# EAGLE design DDS_v1 (EAGLE 7.1.0)
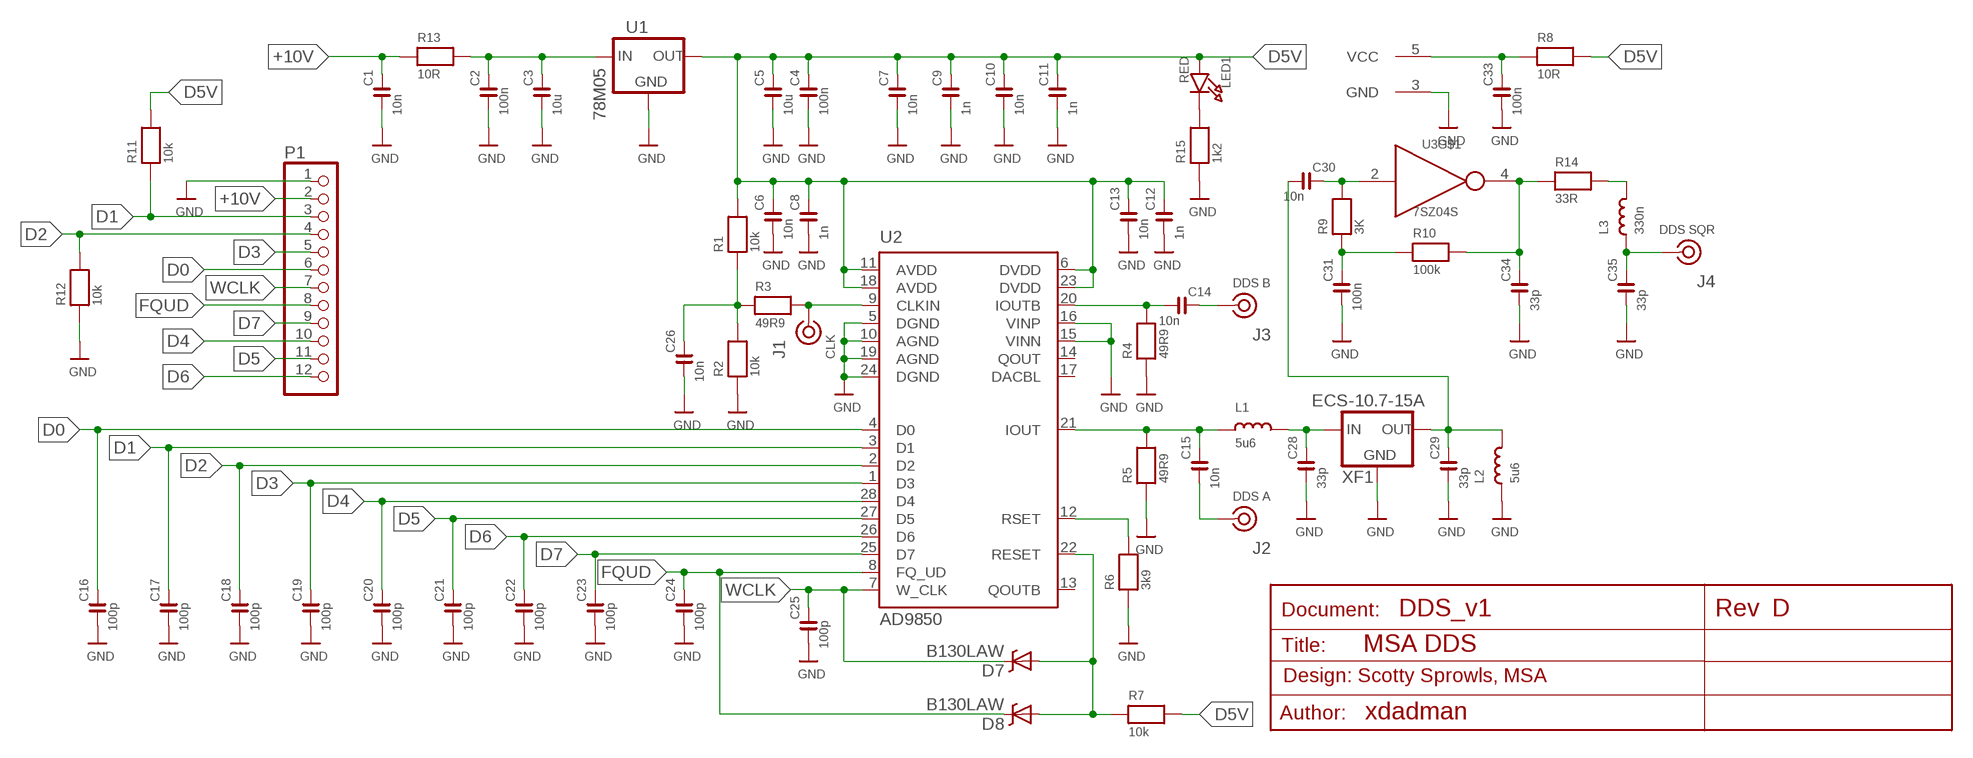
[diagram p0: schematic, sheet 1]

## Parts
C1  10n  C080510N  [C0805]
C2  100n  C0805100N  [C0805]
C3  10u  CC120610U  [C1206]
C4  100n  C0805100N  [C0805]
C5  10u  CC120610U  [C1206]
C6  10n  C080510N  [C0805]
C7  10n  C080510N  [C0805]
C8  1n  C08051N  [C0805]
C9  1n  C08051N  [C0805]
C10  10n  C080510N  [C0805]
C11  1n  C08051N  [C0805]
C12  1n  C08051N  [C0805]
C13  10n  C080510N  [C0805]
C14  10n  C080510N  [C0805]
C15  10n  C080510N  [C0805]
C16  100p  C0805100P  [C0805]
C17  100p  C0805100P  [C0805]
C18  100p  C0805100P  [C0805]
C19  100p  C0805100P  [C0805]
C20  100p  C0805100P  [C0805]
C21  100p  C0805100P  [C0805]
C22  100p  C0805100P  [C0805]
C23  100p  C0805100P  [C0805]
C24  100p  C0805100P  [C0805]
C25  100p  C0805100P  [C0805]
C26  10n  C080510N  [C0805]
C28  33p  C080533P  [C0805]
C29  33p  C080533P  [C0805]
C30  10n  C080510N  [C0805]
C31  100n  C0805100N  [C0805]
C33  100n  C0805100N  [C0805]
C34  33p  C080533P  [C0805]
C35  33p  C080533P  [C0805]
D7  B130LAW  B130LAW-7-FB130LAW-7-F  [SOD-123]
D8  B130LAW  B130LAW-7-FB130LAW-7-F  [SOD-123]
J1  CLK  COAX  [SLIM_COAX_PAD]
J2  DDS A  COAX  [SLIM_COAX_PAD]
J3  DDS B  COAX  [SLIM_COAX_PAD]
J4  DDS SQR  COAX  [SLIM_COAX_PAD]
L1  5u6  L08055U6  [L805]
L2  5u6  L08055U6  [L805]
L3  330n  L0805330N  [L805]
LED1  RED  LED_0603_RED0603  [CHIPLED_0603]
P1  PINHD-1X12  [1X12]
R1  10k  R080510K  [R0805]
R2  10k  R080510K  [R0805]
R3  49R9  R080549R9  [R0805]
R4  49R9  R080549R9  [R0805]
R5  49R9  R080549R9  [R0805]
R6  3k9  R08053K9  [R0805]
R7  10k  R080510K  [R0805]
R8  10R  R080510R  [R0805]
R9  3K  R08053K  [R0805]
R10  100k  R0805100K  [R0805]
R11  10k  R080510K  [R0805]
R12  10k  R080510K  [R0805]
R13  10R  R080510R  [R0805]
R14  33R  R080533R  [R0805]
R15  1k2  R08051K2  [R0805]
U1  78M05  78MXXLDPAK  [TO252]
U2  AD9850  [SSOP28]
U3  7SZ04S  7SZ04SOT-23  [SOT23-5L]
XF1  ECS-10.7-15A  XTALFILTER  [XTALFILTER]

## Nets
+10V: C1.2 P1.2 R13.1
D0: C16.2 P1.6 U2.4(D0)
D1: C17.2 P1.3 R11.1 U2.3(D1)
D2: C18.2 P1.4 R12.2 U2.2(D2)
D3: C19.2 P1.5 U2.1(D3)
D4: C20.2 P1.10 U2.28(D4)
D5: C21.2 P1.11 U2.27(D5)
D5V: C4.2 C5.2 C6.2 C7.2 C8.2 C9.2 C10.2 C11.2 C12.2 C13.2 LED1.A R1.2 R7.2 R8.2 R11.2 U1.2(OUT) U2.6(DVDD) U2.11(AVDD) U2.18(AVDD) U2.23(DVDD)
D6: C22.2 P1.12 U2.26(D6)
D7: C23.2 P1.9 U2.25(D7)
FQUD: C24.2 D8.C P1.8 U2.8(FQ_UD)
GND: C1.1 C2.1 C3.1 C4.1 C5.1 C6.1 C7.1 C8.1 C9.1 C10.1 C11.1 C12.1 C13.1 C16.1 C17.1 C18.1 C19.1 C20.1 C21.1 C22.1 C23.1 C24.1 C25.1 C26.1 C28.1 C29.1 C31.1 C33.1 C34.1 C35.1 L2.1 P1.1 R2.1 R4.1 R5.1 R6.1 R12.1 R15.1 U1.3(GND) U2.5(DGND) U2.10(AGND) U2.15(VINN) U2.16(VINP) U2.19(AGND) U2.24(DGND) U3.3(GND) XF1.3(GND)
N$1: C30.2 R9.2 U3.2(IN)
N$2: C33.2 R8.1 U3.5(VCC)
N$3: C15.2 L1.1 R5.2 U2.21(IOUT)
N$4: C26.2 R1.1 R2.2 R3.1
N$5: C35.2 J4.SIG L3.1
N$6: C14.2 J3.SIG
N$7: C14.1 R4.2 U2.20(IOUTB)
N$8: D7.A D8.A R7.1 U2.22(RESET)
N$9: C2.2 C3.2 R13.2 U1.1(IN)
N$10: R6.2 U2.12(RSET)
N$11: C15.1 J2.SIG
N$12: C28.2 L1.2 XF1.2(IN)
N$13: C31.2 R9.1 R10.1
N$14: C29.2 C30.1 L2.2 XF1.1(OUT)
N$15: L3.2 R14.2
N$16: C34.2 R10.2 R14.1 U3.4(OUT)
N$17: LED1.C R15.2
N$18: J1.SIG R3.2 U2.9(CLKIN)
WCLK: C25.2 D7.C P1.7 U2.7(W_CLK)
Unconnected: U2.13(QOUTB) U2.14(QOUT) U2.17(DACBL)

## Notes on the sheet
- D
- MSA DDS
- Design: Scotty Sprowls, MSA
- xdadman

## Power pins joined to a net without a drawn wire
GND: J1.GND J2.GND J3.GND J4.GND

## Library data of the parts
C1 C6 C7 C10 C13-C15 C26 C30 = MSA_lib:C0805: Ceramic capacitor; OC_FARNELL: 1414662
C2 C4 C31 C33 = MSA_lib:C0805: Ceramic capacitor; OC_FARNELL: 1759166
C3 C5 = MSA_lib:CC1206: Capacitor ceramic 1206; OC_FARNELL: 1611967
C8 C9 C11 C12 = MSA_lib:C0805: Ceramic capacitor; OC_FARNELL: 1833879
C16-C25 = MSA_lib:C0805: Ceramic capacitor; OC_FARNELL: 1414656
C28 C29 C34 C35 = MSA_lib:C0805: Ceramic capacitor; OC_FARNELL: 1800816
D7 D8 = MSA_lib:B130LAW-7-F: Diode shottky; OC_FARNELL: 1858617
J1-J4 = MSA_lib:COAX
L1 L2 = MSA_lib:L0805: 0805 Inductor; OC_FARNELL: 1669565
L3 = MSA_lib:L0805: 0805 Inductor; OC_FARNELL: 9527923
LED1 = MSA_lib:LED_0603_RED: Chip LED 0603 RED 2ma; OC_FARNELL: 1685068
P1 = MSA_lib:PINHD-1X12: PIN HEADER
R1 R2 R7 R11 R12 = MSA_lib:R0805: Resistors; OC_FARNELL: 2073607
R3-R5 = MSA_lib:R0805: Resistors; OC_FARNELL: 2312274
R6 = MSA_lib:R0805: Resistors; OC_FARNELL: 2332079
R8 R13 = MSA_lib:R0805: Resistors; OC_FARNELL: 2332043
R9 = MSA_lib:R0805: Resistors; OC_FARNELL: 2333540
R10 = MSA_lib:R0805: Resistors; OC_FARNELL: 2332098
R14 = MSA_lib:R0805: Resistors; OC_FARNELL: 2331774
R15 = MSA_lib:R0805: Resistors; OC_FARNELL: 9333827
U1 = MSA_lib:78MXXL: VOLTAGE REGULATOR; OC_FARNELL: 2382524
U2 = MSA_lib:AD9850: DDS; OC_FARNELL: 2308695
U3 = MSA_lib:7SZ04; OC_FARNELL: 1417667
XF1 = MSA_lib:XTALFILTER: XTAL Filter ECS-10.7-15A; OC_DIGIKEY: ECS-10.7-15A

## Net classes
1 Cleaerance 20: clearance 0.508 mm

## Board

Size 64 x 32 mm. Coordinates in mm from the lower left corner, seen from the top.
Outline: 0,0 64,0 64,32 0,32 0,0
Copper layers (1*16): Top 0.035mm / dielectric 1.5mm / Bottom 0.035mm
Design rules "kuba_no_CLR": minimum track width 8mil, minimum drill 15mil, track to track 8mil, track to pad 8mil, pad to pad 8mil, via to via 8mil, smd to smd 8mil, copper to edge 0mil, drill to drill 8mil, minimum pad ring 12mil, minimum via ring 10mil, stop-mask expansion 4mil, vias tented up to drill 0mil, thermal gap 10mil

### Footprints (pad centres in the part's own frame; a part is rotated, then mirrored left to right if it is on the bottom)
C0805 = smd 1.2 x 1.5: 1 -0.953,0; 2 0.953,0
C1206 = smd 1.6 x 1.8: 1 -1.4,0; 2 1.4,0
SOD-123 = smd 1.4 x 1.4: A 1.85,0; C -1.85,0
SLIM_COAX_PAD = smd 1.27 x 0.635 bottom: GND 0,-2.667 | drill 1.1: SIG 0,0
L805 = smd 1.3 x 1.5: 1 -0.95,0; 2 0.95,0
CHIPLED_0603 = smd 0.8 x 0.8: A 0,-0.75; C 0,0.75
1X12 = drill 1.016: 1 -13.97,0; 2 -11.43,0; 3 -8.89,0; 4 -6.35,0; 5 -3.81,0; 6 -1.27,0; 7 1.27,0; 8 3.81,0; 9 6.35,0; 10 8.89,0; 11 11.43,0; 12 13.97,0
R0805 = smd 1.3 x 1.5: 1 -0.95,0; 2 0.95,0
TO252 = smd 1 x 1.6: 1 -2.28,-4.8; 2 2.28,-4.8 | smd 5.4 x 6.2: 3 0,2.5
SSOP28 = smd 0.42 x 1.34: 1 -4.16,-3.6; 2 -3.52,-3.6; 3 -2.88,-3.6; 4 -2.24,-3.6; 5 -1.6,-3.6; 6 -0.96,-3.6; 7 -0.32,-3.6; 8 0.32,-3.6; 9 0.96,-3.6; 10 1.6,-3.6; 11 2.24,-3.6; 12 2.88,-3.6; 13 3.52,-3.6; 14 4.16,-3.6; 15 4.16,3.6; 16 3.52,3.6; 17 2.88,3.6; 18 2.24,3.6; 19 1.6,3.6; 20 0.96,3.6; 21 0.32,3.6; 22 -0.32,3.6; 23 -0.96,3.6; 24 -1.6,3.6; 25 -2.24,3.6; 26 -2.88,3.6; 27 -3.52,3.6; 28 -4.16,3.6
SOT23-5L = smd 0.55 x 1.2: 1 -0.95,-1.3; 2 0,-1.3; 3 0.95,-1.3; 4 0.95,1.3; 5 -0.95,1.3
XTALFILTER = smd 1 x 1.6: 1 -2.28,-4.8; 2 2.28,-4.8 | smd 10 x 10: 3 0,2

### Placement (x,y rotation side)
C1  12.45,24.13 270 top
C2  5.84,19.56 180 top
C3  7.62,23.88 90 top
C4  30.99,5.08 180 top
C5  4.83,9.14 0 top
C6  37.59,8.64 90 top
C7  20.83,6.1 90 top
C8  35.31,8.64 90 top
C9  23.11,6.1 90 top
C10  38.61,13.97 270 top
C11  36.58,13.97 270 top
C12  21.08,14.73 270 top
C13  19.05,14.73 270 top
C14  42.16,8.64 270 top
C15  53.59,3.81 180 top
C16  23.37,24.13 270 top
C17  14.73,24.13 270 top
C18  18.8,24.13 270 top
C19  21.08,24.13 270 top
C20  36.07,24.13 270 top
C21  38.35,24.13 270 top
C22  40.64,24.13 270 top
C23  33.78,24.13 270 top
C24  31.5,24.13 270 top
C25  25.65,24.13 270 top
C26  18.54,6.1 90 top
C28  53.59,6.1 180 top
C29  50.29,17.27 180 top
C30  50.29,21.84 0 top
C31  54.1,24.13 0 top
C33  49.28,27.43 270 top
C34  54.61,27.18 90 top
C35  59.44,20.83 180 top
D7  27.69,24.89 90 top
D8  29.46,24.89 90 top
J1  22.35,11.18 0 top
J2  57.91,5.08 90 top
J3  40.13,5.08 0 top
J4  57.66,23.37 0 top
L1  50.55,5.33 90 top
L2  50.29,19.56 180 top
L3  60.45,25.15 90 top
LED1  5.08,6.35 180 top
P1  24.89,21.08 0 top
R1  14.22,8.38 90 top
R2  16.26,6.1 90 top
R3  20.32,11.18 0 top
R4  39.88,8.64 90 top
R5  42.93,13.97 270 top
R6  26.16,5.33 0 top
R7  40.39,13.97 270 top
R8  41.91,27.69 180 top
R9  54.1,21.84 180 top
R10  56.9,27.18 90 top
R11  17.02,14.73 270 top
R12  16.76,24.13 270 top
R13  10.16,24.13 90 top
R14  59.69,27.94 0 top
R15  4.32,4.06 0 top
U1  9.91,14.48 270 top
U2  29.46,12.45 270 top
U3  51.82,26.92 0 top
XF1  55.88,13.21 270 top

### Tracks (layer width: path | path; a pad name or v marks a point on that pad's centre or on a via)
+10V
  Top 1.016: P1.2 12.45,22.1 C1.2 R13.1
D0
  Top 0.406: U2.4 26.88,14.69 27.18,14.99 27.18,17.02 23.88,20.32 23.88,20.83 P1.6 23.62,22.92 C16.2
D1
  Top 0.406: U2.3 24.04,15.33 22.1,17.27 17.02,17.27 16.76,17.02
  Top 0.61: C17.2 14.73,22.1 15.75,21.08 P1.3 16,20.83 16.76,20.07 16.76,17.02 16.76,15.94 R11.1
D2
  Top 0.406: U2.2 24.42,15.97 22.35,18.03 21.59,18.03 P1.4
  Top 0.61: R12.2 C18.2 18.8,21.34 P1.4
D3
  Top 0.406: U2.1 25.56,16.61 P1.5 C19.2
D4
  Top 0.406: U2.28 33.06,20.36 P1.10 33.97,21.08 C20.2
D5
  Top 0.406: U2.27 34,15.97 34.29,16.26 34.29,19.05 P1.11 36.32,21.14 C21.2
D5V
  Top 0.305: R7.2 C10.2 C11.2 36.51,12.95 35.56,12.95 35.11,13.41 U2.23 30.68,13.41 29.46,12.19 29.46,10.25 29.51,10.21 | 29.51,10.21 U2.18 34.69,10.21 C8.2 C6.2 | 29.51,10.21 29.46,10.16 29.42,10.21 U2.11 24.94,10.21 23.11,8.38 C9.2
  Top 0.406: 5.33,12.2 U1.2 3.56,13.75 3.56,23.62 8.13,28.19 40.39,28.19 40.89,27.69 R8.2 | U2.6 24.84,13.41 24.64,13.21 21.65,13.21 C12.2 C13.2 | LED1.A 5.96,7.1 6.23,7.37
  Top 0.61: 29.46,5.08 29.46,4.32 28.7,3.56 8.47,3.56 6.23,5.8 6.23,7.37 C5.2 6.41,9.33 R1.2 17.02,12.13 R11.2 C13.2 | 29.46,5.08 29.46,10.16 | C4.2 29.46,5.08 | C7.2 C9.2
  Top 0.813: 5.33,12.2 5.33,11.69 6.35,10.67 6.35,9.27 C5.2
D6
  Top 0.406: U2.26 34.38,15.33 38.86,19.81 P1.12 38.86,21.4 C22.2
D7
  Top 0.406: U2.25 31.99,14.69 31.24,15.44 P1.9 31.75,21.08 32.77,22.1 32.77,22.16 C23.2
FQUD
  Top 0.406: U2.8 27.11,12.13 28.7,13.72 P1.8 | D8.C 31.36,23.04 C24.2
  Top 0.61: D8.C 29.46,21.84 P1.8
GND  (via drill 0.5)
  Top 0.305: U2.24 34.62,14.05 35.31,14.73 36.39,14.73 C11.1 C10.1
  Top 0.406: C34.1 53.37,26.23 U3.3 52.77,24.51 C31.1 v53.09,24.13 | C13.1 20,15.68 v20.07,15.75 20.13,15.68 C12.1 | C24.1 C23.1 34.73,25.08 v34.8,25.15 34.86,25.08 C20.1 | C22.1 C21.1 37.15,25.08 v37.08,25.15 | U2.10 27.1,10.85 v27.43,11.18 | U2.24 31.17,14.05 v30.73,14.48 | R4.1 C6.1 C8.1 34.99,7.37 33.02,7.37 33.06,7.41 U2.15 U2.16 | U2.19 31.83,10.85 v31.5,11.18 | U2.5 24.56,14.05 v24.38,14.22
  Top 0.61: XF1.3 55.88,15.21 55.88,17.02 55.63,17.27 C29.1 L2.1 | R5.1 45.65,14.92 45.72,14.99 45.72,16.51 v46.23,17.02 | R2.1 C26.1 19.49,5.14 v19.56,5.08 19.81,5.08 19.88,5.14 C7.1 C9.1 25.02,5.14 R6.1 | C25.1 24.45,25.08 v24.38,25.15 | C19.1 C16.1 | C33.1 49.28,29.72 46.99,29.72 v46.23,28.96
  Top 0.813: v50.8,13.21 45.72,13.21 | R12.1 | C19.1 C18.1 18.1,25.08 v18.03,25.15 | C1.1 C17.1 R12.1 | R12.1 17.97,25.08 v18.03,25.15 | v18.03,25.15 18.8,25.15 | C16.1 23.37,25.15 | C28.1 54.55,8.7 54.36,8.89 54.36,9.68 XF1.3
  Top 1.016: U1.3 10.92,15.96 P1.1 9.4,21.08 8,22.48 C3.1 7.62,20.38 C2.1
  Bottom 0.406: v53.09,24.13 53.09,24.38 | v20.07,15.75 20.32,15.75 | v34.8,25.15 35.31,25.15 | v37.08,25.15 36.83,25.15 36.58,24.89 | v30.73,14.48 30.23,14.99 | v31.5,11.18 30.99,11.18 | v24.38,14.22 23.88,14.22 23.62,13.97 23.62,14.22
  Bottom 0.61: v19.56,5.08 20.77,5.08 C7.1 | v24.38,25.15 23.43,25.15
  Bottom 0.813: v18.03,25.15 16.83,25.15 R12.1
  other vias: 61.98,13.21 61.98,18.54 61.98,8.13 61.72,2.03 56.39,2.03 50.04,2.03 43.18,2.03 36.07,2.03 28.96,2.03 22.61,2.03 14.99,2.03 8.13,2.03 1.78,2.03 1.78,6.6 1.78,12.19 1.78,17.27 1.78,21.59 1.78,25.65 1.78,30.23 7.87,30.23 13.72,30.23 19.05,30.23 25.15,30.23 31.24,30.23 37.08,30.23 42.67,29.97 52.58,30.23 57.66,30.23 61.98,29.97 62.23,25.4 46.23,24.64 46.23,21.84 46.23,11.68 46.23,6.35 46.23,2.79 10.16,16.51 14.48,16.51 14.73,12.45 10.16,12.7 12.19,14.48 35.56,14.73 13.46,25.15 24.13,5.08
  pour Top (no thermals): 0,0 64.01,0 64.01,32 0,32 0,3.05 2.79,3.05 2.79,29.21 44.96,29.21 44.96,27.43 47.5,27.43 47.5,29.21 60.96,29.21 60.96,2.79 47.75,2.79 47.75,3.56 45.21,3.56 45.21,2.79 37.34,2.79 37.34,7.62 31.5,7.62 31.5,2.79 0,2.79
  pour Top (no thermals): 47.75,5.33 45.21,5.33 44.96,25.65 47.5,25.65
  pour Bottom: 0,0 64.01,0 64.01,32 0,32
  pour Top (no thermals): 0,4.06 2.79,4.06 2.79,2.79 0,2.79
N$1
  Top 0.406: U3.2 51.82,22.42 C30.2 R9.2
N$2
  Top 0.406: U3.5 50.87,27.75 49.78,26.67 49.47,26.67 C33.2
  Top 0.61: C33.2 44.07,26.48 R8.1
N$3
  Top 0.305: U2.21 34.36,12.13 35.05,11.43 42.67,11.43 42.8,11.56 42.93,11.68 R5.2
  Top 0.406: 42.8,11.56 43.94,10.41 43.94,5.33 44.89,4.38 L1.1 52.07,4.38 C15.2
N$4
  Top 0.61: R1.1 15.87,7.43 R2.2 C26.2 18.54,10.6 19.12,11.18 R3.1
N$5
  Top 0.61: C35.2 58.48,23.18 58.67,23.37
  Top 1.016: J4.SIG 58.67,23.37 59.62,23.37 L3.1
N$6
  Top 1.016: J3.SIG 40.39,5.08 41.91,6.6 41.91,7.43 C14.2
N$7
  Top 0.305: U2.20 33.98,11.49 34.54,10.92 39.12,10.92 39.88,10.16 R4.2 C14.1
N$8
  Top 0.305: U2.22 34.73,12.77 35.56,11.94 41.4,11.94 41.66,12.19 41.66,13.97 40.71,14.92 R7.1 40.64,14.92
  Top 0.406: D7.A D8.A 30.41,26.74 30.73,26.42 41.66,26.42 42.16,25.91 42.16,19.05 40.39,17.27 R7.1
N$9
  Top 0.813: C2.2 4.89,23.18 7.11,25.4 7.5,25.4 C3.2
  Top 1.016: R13.2 7.82,25.08 C3.2 | C2.2 4.89,16.97 U1.1
N$10
  Top 0.305: U2.12 26.76,9.57 27.18,9.14 27.18,5.4 R6.2
N$11
  Top 1.016: C15.1 56.64,3.81 J2.SIG
N$12
  Top 0.61: XF1.2 51.08,8.66 50.55,8.13 L1.2
  Top 1.016: L1.2 52.45,6.28 C28.2
N$13
  Top 0.406: C31.2 55.37,24.13 56.64,25.4 56.64,25.97 R10.1
  Top 0.813: R9.1 C31.2
N$14
  Top 0.406: XF1.1 50.57,16 50.29,16 49.34,16.95 C29.2 L2.2 C30.1
  Top 0.61: XF1.1 51.3,15.49
N$15
  Top 0.406: 60.89,26.54 L3.2
  Top 0.61: 60.89,26.54 60.89,27.69 R14.2
N$16
  Top 0.406: U3.4 54.52,28.22 C34.2 R10.2 58.93,28.13 R14.1
N$17
  Top 0.406: LED1.C 5.08,4.25 R15.2
N$18
  Top 0.406: U2.9 22.92,11.49 J1.SIG
  Top 0.61: R3.2 J1.SIG
WCLK
  Top 0.406: U2.7 26.74,12.77 27.94,13.97 27.94,17.53 26.16,19.3 P1.7 26.16,22.67 C25.2 27.55,23.18 D7.C

### Text on the board
tPlace: D7 | D8 | U3 | C3 | R8 | R13 | C1 | C17 | R12 | C18 | C19 | C16 | C25 | C24 | C23 | C20 | C21 | R14 | C33 | L3 | C22 | C34 | C30 | C35 | C2 | P1 | C31 | R9 | R10 | L2 | J4 DDSSQR | U1 | U2 | R11 | C13 | C12 | C11 | C10 | R7 | R5 | C29 | C8 | C6 | R4 | C14 | R3 | J1CLK | C5 | C26 | C7 | C9 | XF1 | R1 | R6 | L1 | DDS | C28 | LED1 | R2 | C4 | R15 | J3 DDSB | C15 | J2DDSA